# EAGLE design BNO055I+MS5637MiniTeensyShieldv01y (EAGLE 6.6.0)
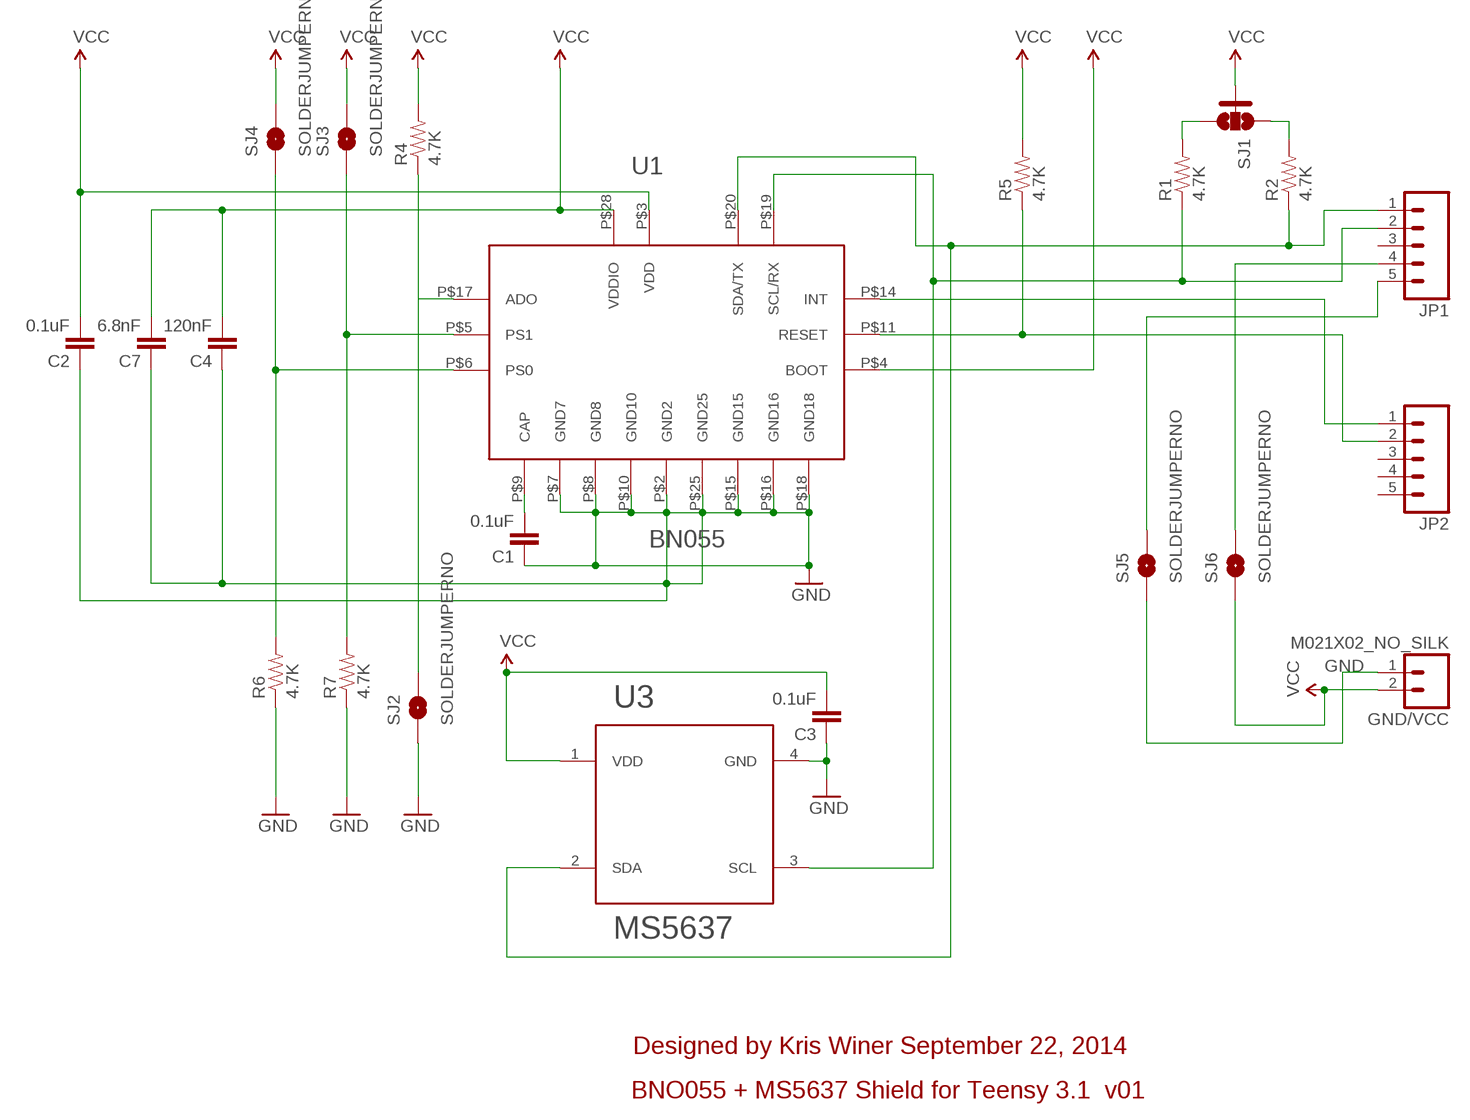
[diagram p0: schematic, sheet 1]

## Parts
C1  0.1uF  0.22UF-25V-10%(0603)  [0603-CAP]
C2  0.1uF  0.22UF-25V-10%(0603)  [0603-CAP]
C3  0.1uF  0.22UF-25V-10%(0603)  [0603-CAP]
C4  120nF  0.22UF-25V-10%(0603)  [0603-CAP]
C7  6.8nF  0.22UF-25V-10%(0603)  [0603-CAP]
GND/VCC  M021X02_NO_SILK  [1X02_NO_SILK]
JP1  M05NO_SILK  [1X05_NO_SILK]
JP2  M05NO_SILK  [1X05_NO_SILK]
R1  4.7K  10K-1%RES-00824  [0603-RES]
R2  4.7K  10K-1%RES-00824  [0603-RES]
R4  4.7K  10K-1%RES-00824  [0603-RES]
R5  4.7K  10K-1%RES-00824  [0603-RES]
R6  4.7K  10K-1%RES-00824  [0603-RES]
R7  4.7K  10K-1%RES-00824  [0603-RES]
SJ1  SOLDERJUMPER_2WAYS  [SJ_3]
SJ2  SOLDERJUMPERNO  [SJ_2S-NO]
SJ3  SOLDERJUMPERNO  [SJ_2S-NO]
SJ4  SOLDERJUMPERNO  [SJ_2S-NO]
SJ5  SOLDERJUMPERNO  [SJ_2S-NO]
SJ6  SOLDERJUMPERNO  [SJ_2S-NO]
U1  BN055  [LGA28]
U3  MS5637  [MS5637QFN-4]

## Nets
GND: C1.1 C2.1 C3.1 C4.1 C7.1 GND/VCC.1 R6.1 R7.1 SJ2.1 SJ5.1 U1.P$2(GND2) U1.P$7(GND7) U1.P$8(GND8) U1.P$10(GND10) U1.P$15(GND15) U1.P$16(GND16) U1.P$18(GND18) U1.P$25(GND25) U3.4(GND)
N$1: JP2.1 U1.P$14(INT)
N$2: JP2.2 R5.1 U1.P$11(RESET)
N$3: C1.2 U1.P$9(CAP)
N$4: R4.1 SJ2.2 U1.P$17(ADO)
N$5: R7.2 SJ3.1 U1.P$5(PS1)
N$8: JP1.4 SJ6.2
N$9: R1.2 SJ1.3
N$10: R2.2 SJ1.1
N$11: JP1.5 SJ5.2
N$13: R6.2 SJ4.1 U1.P$6(PS0)
SCL: JP1.2 R1.1 U1.P$19(SCL/RX) U3.3(SCL)
SDA: JP1.1 R2.1 U1.P$20(SDA/TX) U3.2(SDA)
VCC: C2.2 C3.2 C4.2 C7.2 GND/VCC.2 R4.2 R5.2 SJ1.2 SJ3.2 SJ4.2 SJ6.1 U1.P$3(VDD) U1.P$4(BOOT) U1.P$28(VDDIO) U3.1(VDD)
Unconnected: JP1.3 JP2.3 JP2.4 JP2.5

## Notes on the sheet
- Designed by Kris Winer September 22, 2014
- BNO055 + MS5637 Shield for Teensy 3.1  v01

## Library data of the parts
C1-C4 C7 = SparkFun-Capacitors:0.22UF-25V-10%(0603): CAP-07822; PROD_ID: CAP-07822; VALUE: 0.22uF
GND/VCC = SparkFun-Connectors:M02: Standard 2-pin 0.1" header. Use with - straight break away headers ( PRT-00116) - right angle break away headers (PRT-00553) - swiss pins (PRT-00743) - machine pins (PRT-00117) - female headers (PRT-00115) Molex polarized connector foot print use with: PRT-08233 with associated crimp pins and housings. 2.54_SCREWTERM for use with PRT-10571. 3.5mm Screw Terminal footprints for PRT-08084 5mm Screw Terminal footprints for use with PRT-08433
JP1 JP2 = SparkFun-Connectors:M05: Header 5 Standard 5-pin 0.1" header. Use with straight break away headers (SKU : PRT-00116), right angle break away headers (PRT-00553), swiss pins (PRT-00743), machine pins (PRT-00117), and female headers (PRT-00115). Molex polarized connector foot print use with SKU : PRT-08230 with associated crimp pins and housings.
R1 R2 R4-R7 = SparkFun-Resistors:10K-1%: 10k-ohm SMT 1/10W - 1% (0603) RES-00824; PROD_ID: RES-00824; VALUE: 10k
SJ1 = SparkFun-Passives:SOLDERJUMPER_2WAY: Solder Jumper 2 way solder jumper
SJ2-SJ6 = SparkFun-Retired:SOLDERJUMPER: Solder Jumper Standard SMD solder jumper. Used to automate production. Two varients : Normally Open and Normally Closed are the same, but have different paste layers. NC will have a large amount of paste and should jumper during reflow.
U1 = SparkFun-DigitalIC:BN055
U3 = SparkFun-DiscreteSemi:MS5637: MS5637 I2C pressure sensor in QFN-4 package by Measurement Specialties

## Board
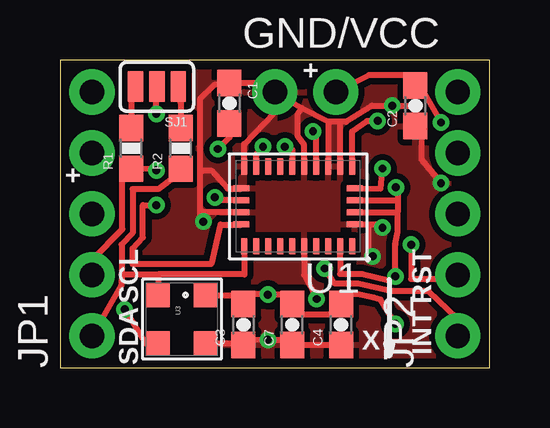
[diagram p1: board, top side]
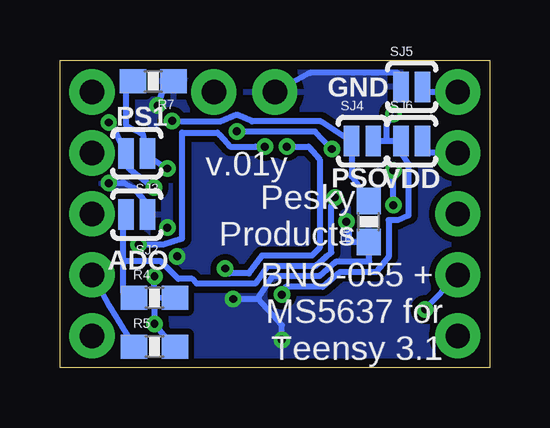
[diagram p2: board, bottom side, seen from below]

Size 17.91 x 12.83 mm. Coordinates in mm from the lower left corner, seen from the top.
Outline: 0,0 17.91,0 17.91,12.83 0,12.83 0,0
Copper layers (1*16): Top 0.0356mm / dielectric 1.5011mm / Bottom 0.0356mm
Design rules "OSHPark *": minimum track width 6mil, minimum drill 13mil, track to track 6mil, track to pad 6mil, pad to pad 6mil, via to via 6mil, smd to smd 6mil, copper to edge 15mil, drill to drill 6mil, minimum pad ring 7mil, minimum via ring 7mil, stop-mask expansion 3mil, vias tented up to drill 20mil, thermal gap 10mil

### Footprints (pad centres in the part's own frame; a part is rotated, then mirrored left to right if it is on the bottom)
0603-CAP = smd 1.1 x 1: 1 -0.85,0; 2 0.85,0
1X02_NO_SILK = drill 1.016 pad 1.88: 1 0,0; 2 2.54,0
1X05_NO_SILK = drill 1.016 pad 1.88: 1 0,0; 2 2.54,0; 3 5.08,0; 4 7.62,0; 5 10.16,0
0603-RES = smd 1.1 x 1: 1 -0.85,0; 2 0.85,0
SJ_3 = smd 0.635 x 1.27: 1 -0.889,0; 2 0,0; 3 0.889,0
SJ_2S-NO = smd 0.635 x 1.27: 1 -0.45,0; 2 0.45,0
LGA28 = smd 0.25 x 0.675: P$1 -2.25,1.663; P$6 -2.25,-1.663; P$7 -1.75,-1.663; P$8 -1.25,-1.663; P$9 -0.75,-1.663; P$10 -0.25,-1.663; P$11 0.25,-1.663; P$12 0.75,-1.663; P$13 1.25,-1.663; P$14 1.75,-1.663; P$15 2.25,-1.663; P$20 2.25,1.663; P$21 1.75,1.663; P$22 1.25,1.663; P$23 0.75,1.663; P$24 0.25,1.663; P$25 -0.25,1.663; P$26 -0.75,1.663; P$27 -1.25,1.663; P$28 -1.75,1.663 | smd 0.675 x 0.25: P$2 -2.362,0.75; P$3 -2.362,0.25; P$4 -2.362,-0.25; P$5 -2.362,-0.75; P$16 2.362,-0.75; P$17 2.362,-0.25; P$18 2.362,0.25; P$19 2.362,0.75
MS5637QFN-4 = smd 1 x 1: 1 -1,1; 2 -1,-1; 3 1,-1; 4 1,1

### Placement (x,y rotation side)
C1  7.06,11.02 270 top
C2  14.81,10.92 90 top
C3  7.65,1.8 90 top
C4  11.71,1.8 90 top
C7  9.68,1.8 90 top
GND/VCC  8.95,11.49 0 top
JP1  1.33,1.33 90 top
JP2  16.57,1.33 90 top
R1  2.97,9.14 90 top
R2  5.03,9.14 90 top
R4  13.97,2.91 0 bottom
R5  13.97,0.89 0 bottom
R6  5.04,6.1 90 bottom
R7  14.02,11.94 180 bottom
SJ1  4.04,11.72 180 top
SJ2  14.71,6.39 180 bottom
SJ3  14.71,8.94 180 bottom
SJ4  5.31,9.45 0 bottom
SJ5  3.25,11.71 0 bottom
SJ6  3.25,9.45 0 bottom
U1  9.92,6.73 180 top
U3  5.08,2.03 270 top

### Tracks (layer width: path | path; a pad name or v marks a point on that pad's centre or on a via)
GND  (via drill 0.33)
  Top 0.254: U3.4 7.47,1.03 C3.1 7.66,1.18 v8.66,1.17 9.46,1.17 C7.1 C4.1 | GND/VCC.1 9.13,11.39 9.63,11.06 10.07,10.82 | U1.P$25 10.17,3.87 v10.69,2.87 | 5.83,8.23 5.83,11.19 6.48,11.81 7,11.84 C1.1 8.68,11.87 GND/VCC.1 | 5.83,8.23 5.83,6.6 | 5.83,6.6 5.83,6.12 v5.97,6.1 | U1.P$7 11.67,10.25 | 11.67,10.25 11.17,10.25 | 11.17,10.25 U1.P$8 | U1.P$2 12.84,5.98 | 12.84,5.98 13.24,5.98 13.39,5.97 v13.44,5.84 | 11.67,10.25 11.93,10.25 13.01,10.92 v13.84,10.92 14.83,10.92 C2.1 15.06,9.68 15.06,8.69 v15.88,7.7 | 11.17,10.25 10.07,10.82 | 5.83,8.23 5.93,8.2 6.33,8.2 6.99,7.47 7.54,7.47 U1.P$16 | U1.P$15 7.67,9.32 8.94,10.64 GND/VCC.1 | U1.P$10 10.17,9.29 9.91,9.65 9.91,10.56 10.07,10.82 | U1.P$18 5.96,6.48 5.83,6.6 | 12.84,5.98 12.84,4.74 v13.03,4.65
  Bottom 0.254: SJ5.1 3.83,12.29 7.49,12.29 GND/VCC.1 | v13.84,10.92 13.59,11.66 13.17,11.85 R7.1 | v5.97,6.1 5.86,6.02 5.86,5.22 R6.1 5.03,5.23 5.03,4.45 5.03,4.42 6.43,4.42 7.1,3.82 9.04,3.82 9.68,2.87 | v10.69,2.87 9.68,2.87 | v8.66,1.17 8.66,1.78 9.68,2.87 | v15.88,7.7 15.32,7.72 15.24,7.72 14.83,7.49 14.28,6.83 14.28,6.28 SJ2.1
  pour Bottom (isolate 0.254): 0,12.83 0,-0.03 17.86,-0.03 17.86,12.8
  pour Top (isolate 0.254): 0.03,12.8 0.03,-0.03 3.3,-0.03 3.3,3.76 6.78,3.76 6.78,-0.03 17.91,-0.03 17.91,12.8
N$1  (via drill 0.33)
  Top 0.254: U1.P$14 8.17,8.88 v8.46,9.22 | v11.02,4.14 11.46,3.5 12.42,3.5 13.79,3.19 15.37,3.19 16.57,2.04 JP2.1
  Bottom 0.254: v8.46,9.22 7.54,9.22 7.09,8.69 7.09,5 7.42,4.67 9.5,4.67 10.03,3.94 10.85,3.94 11.02,4.12 v11.02,4.14
N$2  (via drill 0.33)
  Top 0.254: v9.37,9.22 9.68,9.08 U1.P$11 | v14.63,5.13 14.63,3.71 16.13,3.71 16.56,3.89 JP2.2
  Bottom 0.254: JP2.2 15.87,2.6 R5.1 | 9.75,9.22 v9.37,9.22 10.82,9.22 11.25,9.7 11.35,9.8 12.81,9.8 12.81,5.38 13.61,5.13 v14.63,5.13
N$3  (via drill 0.33)
  Top 0.254: U1.P$9 10.67,9.73 v10.54,9.86 | v6.58,9.12 7.06,9.6 C1.2
  Bottom 0.254: v10.54,9.86 7.29,9.86 v6.58,9.12
N$4  (via drill 0.33)
  Top 0.254: v6.45,7.11 6.48,6.99 U1.P$17
  Bottom 0.254: v6.45,7.11 6.6,6.78 6.6,4.81 6.82,4.64 7.26,4.24 9.27,4.24 9.78,3.5 12.22,3.5 12.39,3.71 12.98,3.71 13.72,4.45 15.27,4.45 | 15.21,6.2 SJ2.2 15.27,6.32 15.27,4.45 | R4.1 15.27,3.11 15.27,4.45
N$5  (via drill 0.33)
  Top 0.254: U1.P$5 13.36,7.47 13.44,8.18 v13.44,8.31
  Bottom 0.254: R7.2 15.16,11.51 15.16,10.11 14.45,9.73 14.3,8.71 SJ3.1 | SJ3.1 14.26,8.68 | SJ3.1 14.28,8.86 v13.44,8.31
N$8
  Bottom 0.254: JP1.4 2.81,8.95 SJ6.2
N$9
  Top 0.254: SJ1.3 2.97,11.14 R1.2
N$10
  Top 0.254: SJ1.1 5.03,11.06 R2.2
N$11
  Bottom 0.254: JP1.5 2.79,11.49 SJ5.2
N$13  (via drill 0.33)
  Top 0.254: U1.P$6 12.17,9.86 12.8,10.29 v13.23,10.29
  Bottom 0.254: R6.2 5.76,7.98 SJ4.1 7.03,10.27 9.91,10.27 10.54,10.54 11.23,10.26 12.83,10.26 v13.23,10.29
SCL  (via drill 0.33)
  Top 0.254: JP1.2 1.33,4.51 2.6,5.78 2.6,7.82 R1.1 3.96,8.28 v4.01,8.23 | v2.69,2.44 3.56,1.02 4.06,1.02 U3.3 | U1.P$19 7.54,5.97 6.68,5.97 6.3,4.32 3.02,4.32 3.02,4.98 3.45,5.44 3.45,6.78 v4.01,6.78
  Bottom 0.254: JP1.2 1.38,3.82 v2.69,2.44 | v4.01,6.78 v4.01,8.23
SDA
  Top 0.254: R2.1 4.79,7.96 4.09,7.44 3.02,7.44 3.02,5.61 2.56,5.13 2.56,3.9 | JP1.1 2.55,3.44 2.56,3.44 2.56,3.9 | U1.P$20 7.67,5.05 7.68,3.9 4.09,3.9 | 4.09,3.9 4.08,3.13 U3.2 4.03,3.03 | 2.56,3.9 4.09,3.9
VCC  (via drill 0.33)
  Top 0.254: U3.1 7.47,3.03 C3.2 8.05,3.06 8.69,3.06 | v13.97,1.83 13.36,2.85 13.08,2.92 12.98,2.95 12.39,3.07 12.1,3.07 C4.2 11.24,2.23 10.11,2.23 9.68,2.62 C7.2 9.27,3.06 8.69,3.06 | GND/VCC.2 12.88,12.19 14.5,12.19 C2.2 15.18,11.47 v15.88,10.22 | U1.P$28 11.67,4.56 11.67,3.91 12.57,3.91 13.69,3.66 v13.97,3.81 13.97,5.14 14.07,5.66 14.07,6.48 | v13.99,7.52 14.07,7.64 14.07,7.04 | 14.07,7.04 14.07,6.48 | v8.66,3.05 8.69,3.06 | U1.P$3 14.07,6.48 | v4.01,10.58 4.01,11.69 SJ1.2 | U1.P$4 14.02,6.98 14.07,7.04
  Bottom 0.254: 4.29,9.45 SJ6.1 3.71,9 3.38,8.48 3.38,6.35 3.84,6.16 4.22,6.16 4.22,4.62 4.69,4.05 4.72,3.99 6.25,3.99 6.96,3.38 8.51,3.38 v8.66,3.05 | 4.29,9.45 SJ4.2 | R5.2 13.46,1.21 v13.97,1.83 13.97,2.93 | v15.88,10.22 15.77,10.19 15.29,9.2 15.16,9.11 SJ3.2 15.15,8.46 15,8.28 14.3,7.73 v13.99,7.52 | 4.29,9.45 4.29,10.13 v4.01,10.58 | 13.97,2.93 R4.2 | 13.97,2.93 v13.97,3.81

### Text on the board
tPlace: + | + | RST | SCL | INT | X | SDA
bPlace: GND | PS1 | v.01y | VDD | PSO | Pesky / Products | ADO | BNO-055 + / MS5637 for / Teensy 3.1